# Altium schematic sheet Sheet1.SchDoc
size A
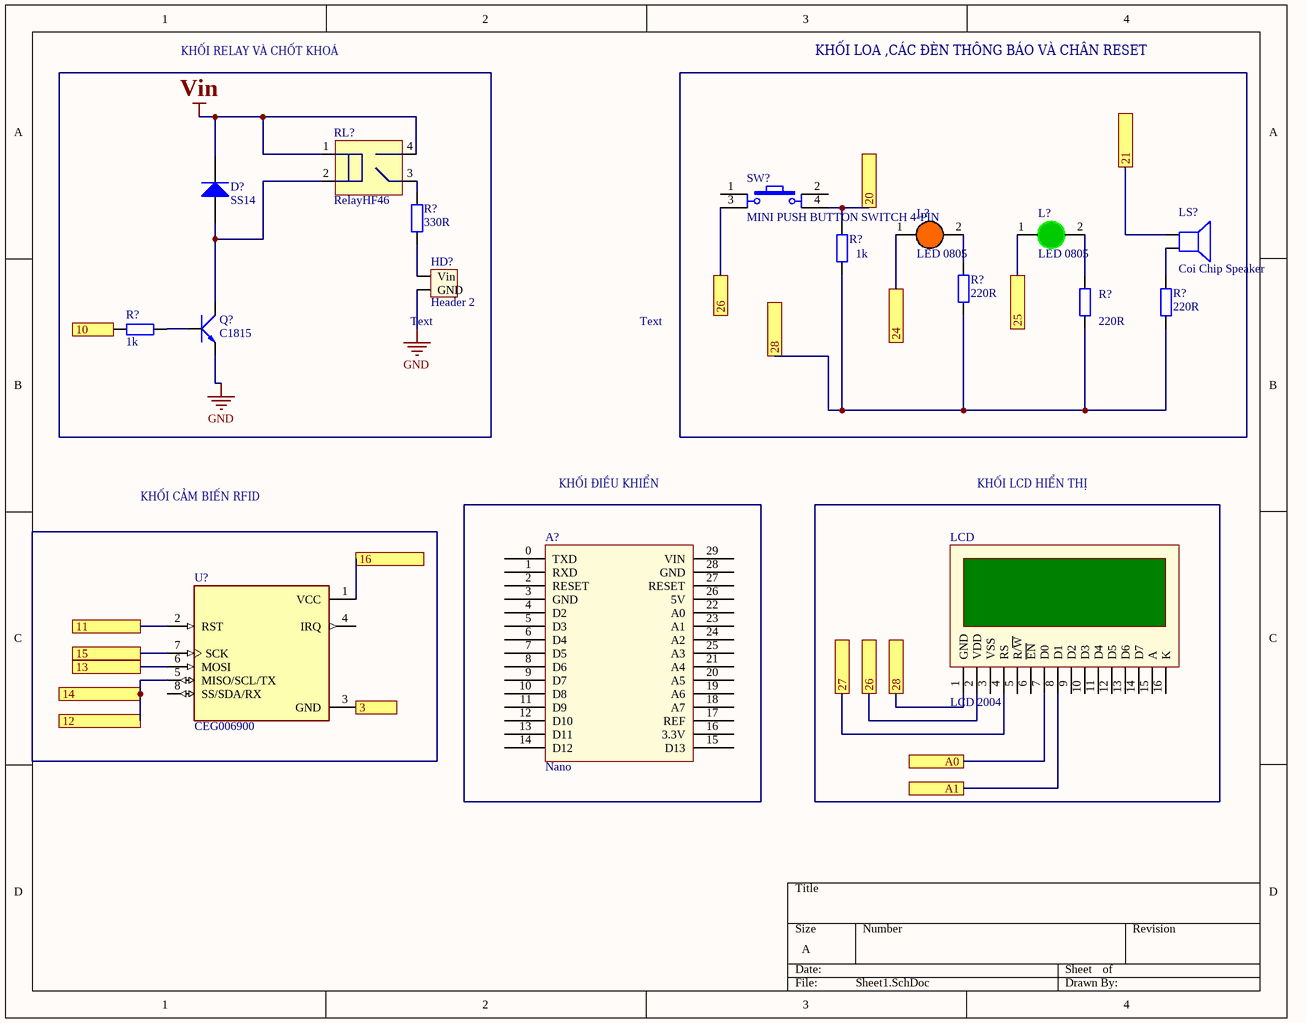
[diagram p0: Sheet1.SchDoc]

## Parts
(Parts that share a designator on the sheet are numbered #1, #2 ... from top to bottom, then left to right.)
A?  Nano  [Arduino nano]
D?  SS14  [DIODE SMA]
HD?  Header 2  [HED2]
L?#1  LED 0805  [LED-0805-Orange]
L?#2  LED 0805  [LED-0805-Green]
LCD  LCD 2004  [LCD 2004]
LS?  Coi Chip Speaker  [Coi Chip Speacker]
Q?  C1815  [TO92]
R?#1  330R  [Tro SMD 0805]
R?#2  1k  [tro smd 0603]
R?#3  220R  [tro smd 0603]
R?#4  220R  [tro smd 0603]
R?#5  220R  [tro smd 0603]
R?#6  1k  [tro smd 0805]
RL?  RelayHF46  [Relay 4 chan HF46F]
SW?  MINI PUSH BUTTON SWITCH 4-PIN  [SW_70_31.5D47_TH_ST]
U?  CEG006900  [MODULE_CEG006900]

## Ports
3, 10, 11, 12, 13, 14, 15, 16, 20, 21, 24, 25, 26, 27, 28, A0, A1

## Nets
GND: HD?.2(GND) Q?.1(E)
Vin: D?.2(K) RL?.1 RL?.4(AC/DC)
3: U?.3(GND) ; port 3
10: R?#6.1 ; port 10
11: U?.2(RST) ; port 11
12: U?.5(MISO/SCL/TX) ; port 14, port 12
13: U?.6(MOSI) ; port 13
15: U?.7(SCK) ; port 15
16: U?.1(VCC) ; port 16
20: R?#2.2 SW?.4 ; port 20
21: LS?.1 ; port 21
24: L?#1.1(A) ; port 24
25: L?#2.1(A) ; port 25
26: LCD.2(VDD) SW?.3 ; port 26
27: LCD.4(RS) ; port 27
28: LCD.1(GND) R?#2.1 R?#3.1 R?#4.1 R?#5.1 ; port 28
A0: LCD.7(D0) ; port A0
A1: LCD.8(D1) ; port A1
NetD?_1: D?.1(A) Q?.2(C) RL?.2
NetHD?_1: HD?.1(Vin) R?#1.1
NetL?#1_2: L?#1.2(K) R?#3.2
NetL?#2_2: L?#2.2(K) R?#4.2
NetLS?_2: LS?.2 R?#5.2
NetQ?_3: Q?.3(B) R?#6.2
NetR?#1_2: R?#1.2 RL?.3(AC/DC)

Not connected (* = marked no-connect by the designer): A? 0(TXD) 1(RXD) 2(RESET) 3(GND) 4(D2) 5(D3) 6(D4) 7(D5) 8(D6) 9(D7) 10(D8) 11(D9) 12(D10) 13(D11) 14(D12) 15(D13) 16(3.3V) 17(REF) 18(A7) 19(A6) 20(A5) 21(A4) 22(A0) 23(A1) 24(A2) 25(A3) 26(5V) 27(RESET) 28(GND) 29(VIN); LCD 3(VSS) 5(R/~{W}) 6(~{EN}) 9(D2) 10(D3) 11(D4) 12(D5) 13(D6) 14(D7) 15(A) 16(K); SW? 1 2; U? 4(IRQ) 8(SS/SDA/RX)

## Notes on the sheet
- KHỐI RELAY VÀ CHỐT KHOÁ
- KHỐI LOA ,CÁC ĐÈN THÔNG BÁO VÀ CHÂN RESET
- (near HD?) Text
- Text
- KHỐI CẢM BIẾN RFID
- KHỐI ĐIỀU KHIỂN
- KHỐI LCD HIỂN THỊ

## Library data of the parts
A? = Arduino Nano
D? = Diode SS14 ( 1N5819): Dán; Ma_Hang: MH002211; Don_Vi: Con; Ten_Linh_Kien: Diode SS14 DO214 Schottky 1A 40V ( 1N5819 DO214); Chung_Loai: Dán; Ghi_Chu: *; Kieu_Chan: *
HD? = Hed2: Header 2 (Green); Value: Header 2
L?#1 = LED 0805 Cam: Dán; Don_Vi: Con; Ma_Hang: MH002328; Ten_Linh_Kien: LED 0805 Màu Cam ( Orange); Ghi_Chu: *; Kieu_Chan: *; Chung_Loai: Dán
L?#2 = LED 0805 Xanh La: Dán; Don_Vi: Con; Ma_Hang: MH002326; Ten_Linh_Kien: LED 0805 Màu Xanh Lá (Green); Ghi_Chu: *; Kieu_Chan: *; Chung_Loai: Dán
LCD = LCD 2004 5V: LCD 2004 5V Xanh Dương; Ten: LCD 2004 Xanh Dương; Ma_Hang: WVEZ; CHIP: HD44780; Don Vi Mua: Nshop
LS? = Coi Chip Speaker: Còi chip
Q? = C1815: NPN transistor; Value: C9014
R?#1 = Tro 0805 5% 330R: Dán; Don_Vi: Con; So_Chan: 2; Ten_Linh_Kien: Trở 0805 5% 330R; Ma_Hang: MH005337; Chung_Loai: Dán; Kieu_Chan: *
R?#2 = Tro 0603 1% 1k: Dán; So_Chan: 2; Don_Vi: Con; Ten_Linh_Kien: Trở 0603 1% 1k; Ma_Hang: MH006334; Chung_Loai: Dán; Kieu_Chan: *
R?#3-R?#5 = Tro 0603 5% 220R: Dán; Don_Vi: Con; So_Chan: 2; Ten_Linh_Kien: Trở 0603 5% 220R; Ma_Hang: MH006322; Chung_Loai: Dán; Kieu_Chan: *
R?#6 = Tro 0805 1% 1k: Dán; Don_Vi: Con; So_Chan: 2; Ten_Linh_Kien: Trở 0805 1% 1k; Ma_Hang: MH005468; Chung_Loai: Dán; Kieu_Chan: *
RL? = Relay 4 chan HF46F: Ten: Relay 5V5A HF46F-G 5-HS1; Ma_Hang: MH003879
SW? = SW2_BUTT-4-TH: Tactile Switches MINI PUSH BUTTON SWITCH 4-PIN QTY. 4; Manufacturer: Gravitech; Manufacturer Part Number: BUTT-4; Alternate Part Number-1: NA; Case/Package: TH; Supplier-1: SP ROAD; Supplier Part Number-1: BUTT-4
U? = CEG006900: RFID RC522 Reader IC Card Module Tags SPI Interface Read and Write; MF: YKS; Value: *; SnapEDA_Link: https://www.snapeda.com/parts/CEG006900/YKS/view-part/?ref=snap; MP: CEG006900; Check_prices: https://www.snapeda.com/parts/CEG006900/YKS/view-part/?ref=eda; Availability: Not in stock; Price: None; Package: None